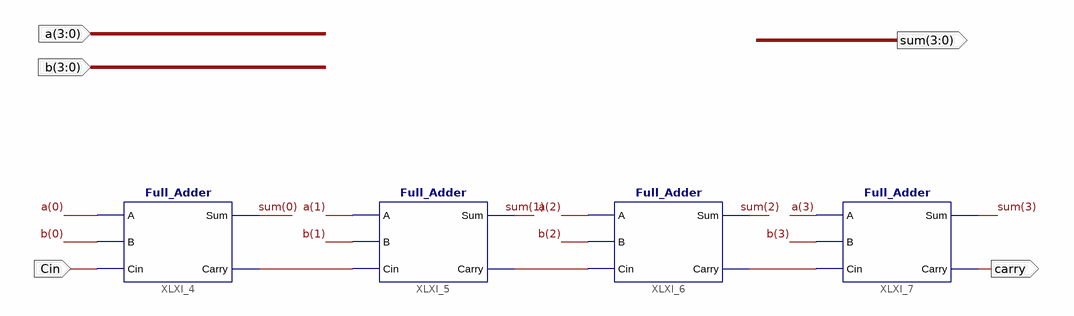
[diagram p0: schematic sheet 1]
// Xilinx ISE schematic Adder_4Bits.sch (spartan3) as structural Verilog: 4 symbols, 5 ports
module Adder_4Bits (
  input  [3:0] a,
  input  [3:0] b,
  input  Cin,
  output [3:0] sum,
  output carry
);

  wire XLXN_1, XLXN_2, XLXN_3;

  Full_Adder XLXI_4 (.A(a[0]), .B(b[0]), .Cin(Cin), .Sum(sum[0]), .Carry(XLXN_1));
  Full_Adder XLXI_7 (.A(a[3]), .B(b[3]), .Cin(XLXN_3), .Sum(sum[3]), .Carry(carry));
  Full_Adder XLXI_5 (.A(a[1]), .B(b[1]), .Cin(XLXN_1), .Sum(sum[1]), .Carry(XLXN_2));
  Full_Adder XLXI_6 (.A(a[2]), .B(b[2]), .Cin(XLXN_2), .Sum(sum[2]), .Carry(XLXN_3));
endmodule
